# Altium schematic sheet 0-OverView.SCHDOC
size A4
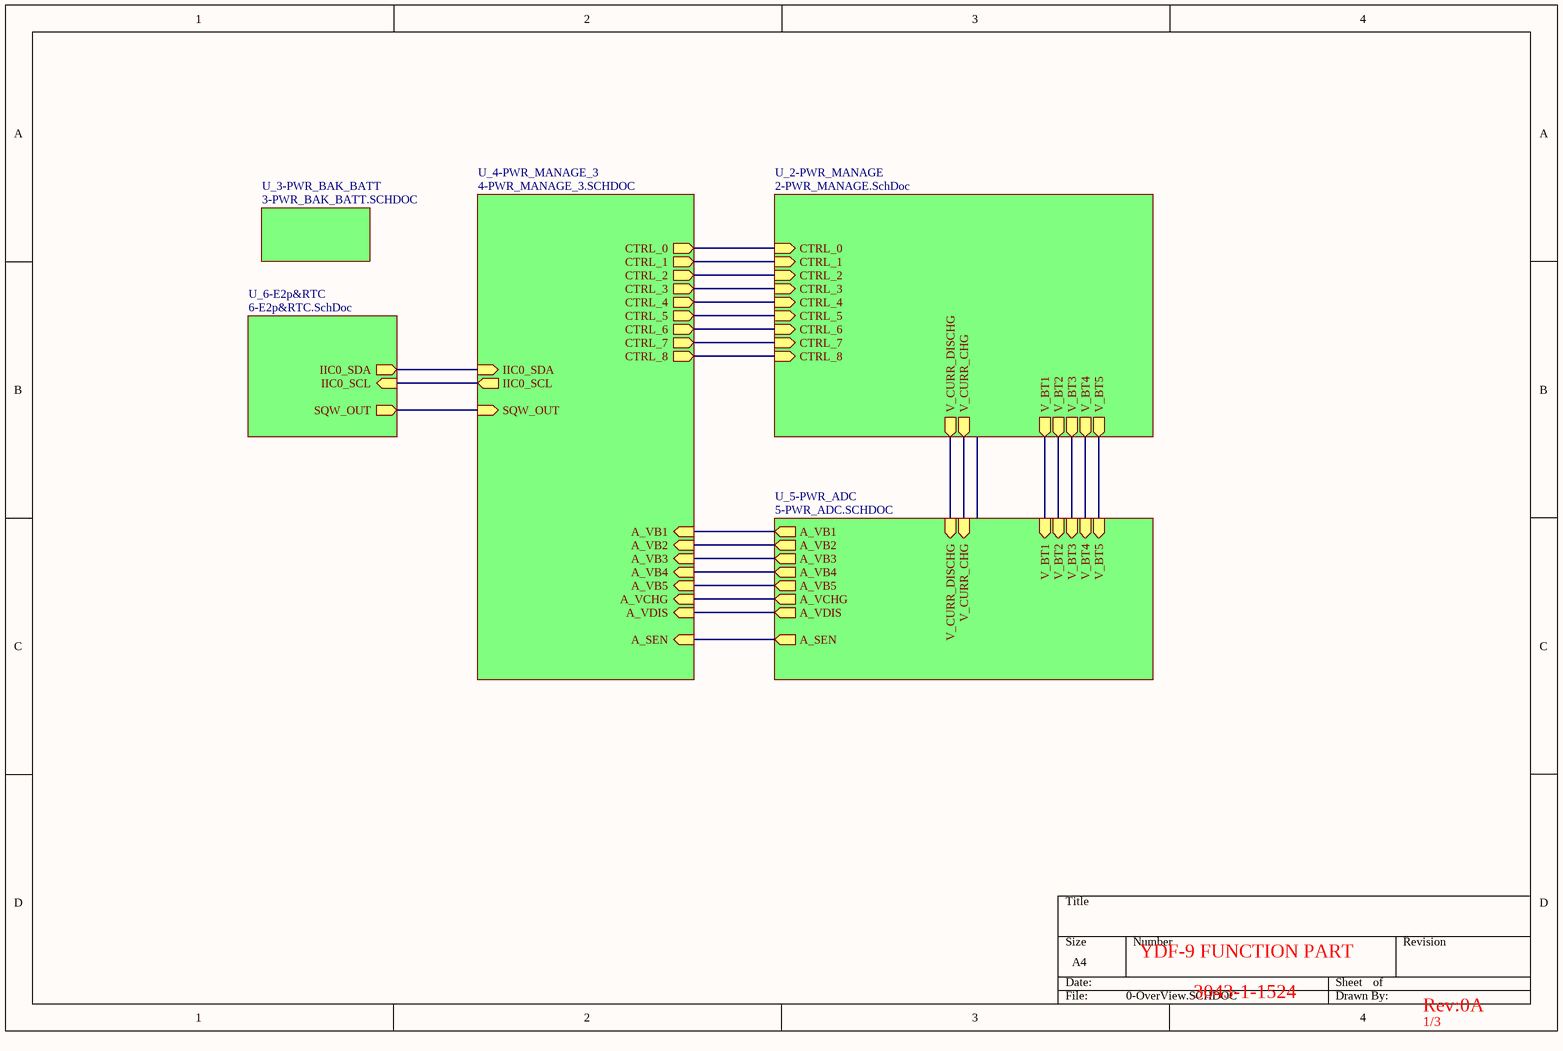
[diagram p0: 0-OverView.SCHDOC]

## Sub-sheets
U_2-PWR_MANAGE = 2-PWR_MANAGE.SchDoc: V_BT1 (out), V_BT2 (out), V_BT3 (out), V_BT4 (out), V_BT5 (out), V_CURR_CHG (out), V_CURR_DISCHG (out), CTRL_8 (in), CTRL_0 (in), CTRL_2 (in), CTRL_7 (in), CTRL_1 (in), CTRL_4 (in), CTRL_3 (in), CTRL_5 (in), CTRL_6 (in)
U_3-PWR_BAK_BATT = 3-PWR_BAK_BATT.SCHDOC: no entries
U_4-PWR_MANAGE_3 = 4-PWR_MANAGE_3.SCHDOC: IIC0_SDA (in), IIC0_SCL (out), SQW_OUT (in), A_VDIS (in), A_VB5 (in), A_VCHG (in), A_VB1 (in), A_VB4 (in), A_VB2 (in), A_VB3 (in), CTRL_1 (out), CTRL_0 (out), CTRL_2 (out), CTRL_3 (out), CTRL_4 (out), CTRL_5 (out), CTRL_8 (out), CTRL_6 (out), CTRL_7 (out), A_SEN (in)
U_5-PWR_ADC = 5-PWR_ADC.SCHDOC: V_BT5 (in), V_BT3 (in), V_BT2 (in), V_BT4 (in), V_BT1 (in), A_VDIS (out), A_VB3 (out), A_VB5 (out), A_VB1 (out), A_VB4 (out), A_VCHG (out), A_VB2 (out), V_CURR_DISCHG (in), V_CURR_CHG (in), A_SEN (out)
U_6-E2p&RTC = 6-E2p&RTC.SchDoc: IIC0_SCL (in), IIC0_SDA (out), SQW_OUT (out)

## Nets
(unnamed): sheet U_2-PWR_MANAGE/V_BT1, sheet U_5-PWR_ADC/V_BT1
(unnamed): sheet U_2-PWR_MANAGE/V_BT2, sheet U_5-PWR_ADC/V_BT2
(unnamed): sheet U_2-PWR_MANAGE/V_BT3, sheet U_5-PWR_ADC/V_BT3
(unnamed): sheet U_2-PWR_MANAGE/V_BT4, sheet U_5-PWR_ADC/V_BT4
(unnamed): sheet U_2-PWR_MANAGE/V_BT5, sheet U_5-PWR_ADC/V_BT5
(unnamed): sheet U_2-PWR_MANAGE/V_CURR_CHG, sheet U_5-PWR_ADC/V_CURR_CHG
(unnamed): sheet U_2-PWR_MANAGE/V_CURR_DISCHG, sheet U_5-PWR_ADC/V_CURR_DISCHG
(unnamed): sheet U_2-PWR_MANAGE/CTRL_8, sheet U_4-PWR_MANAGE_3/CTRL_8
(unnamed): sheet U_2-PWR_MANAGE/CTRL_0, sheet U_4-PWR_MANAGE_3/CTRL_0
(unnamed): sheet U_2-PWR_MANAGE/CTRL_2, sheet U_4-PWR_MANAGE_3/CTRL_2
(unnamed): sheet U_2-PWR_MANAGE/CTRL_7, sheet U_4-PWR_MANAGE_3/CTRL_7
(unnamed): sheet U_2-PWR_MANAGE/CTRL_1, sheet U_4-PWR_MANAGE_3/CTRL_1
(unnamed): sheet U_2-PWR_MANAGE/CTRL_4, sheet U_4-PWR_MANAGE_3/CTRL_4
(unnamed): sheet U_2-PWR_MANAGE/CTRL_3, sheet U_4-PWR_MANAGE_3/CTRL_3
(unnamed): sheet U_2-PWR_MANAGE/CTRL_5, sheet U_4-PWR_MANAGE_3/CTRL_5
(unnamed): sheet U_2-PWR_MANAGE/CTRL_6, sheet U_4-PWR_MANAGE_3/CTRL_6
(unnamed): sheet U_4-PWR_MANAGE_3/IIC0_SDA, sheet U_6-E2p&RTC/IIC0_SDA
(unnamed): sheet U_4-PWR_MANAGE_3/IIC0_SCL, sheet U_6-E2p&RTC/IIC0_SCL
(unnamed): sheet U_4-PWR_MANAGE_3/SQW_OUT, sheet U_6-E2p&RTC/SQW_OUT
(unnamed): sheet U_4-PWR_MANAGE_3/A_VDIS, sheet U_5-PWR_ADC/A_VDIS
(unnamed): sheet U_4-PWR_MANAGE_3/A_VB5, sheet U_5-PWR_ADC/A_VB5
(unnamed): sheet U_4-PWR_MANAGE_3/A_VCHG, sheet U_5-PWR_ADC/A_VCHG
(unnamed): sheet U_4-PWR_MANAGE_3/A_VB1, sheet U_5-PWR_ADC/A_VB1
(unnamed): sheet U_4-PWR_MANAGE_3/A_VB4, sheet U_5-PWR_ADC/A_VB4
(unnamed): sheet U_4-PWR_MANAGE_3/A_VB2, sheet U_5-PWR_ADC/A_VB2
(unnamed): sheet U_4-PWR_MANAGE_3/A_VB3, sheet U_5-PWR_ADC/A_VB3
(unnamed): sheet U_4-PWR_MANAGE_3/A_SEN, sheet U_5-PWR_ADC/A_SEN

## Notes on the sheet
- YDF-9 FUNCTION PART
- 3043-1-1524
- Rev:0A
- 1/3